# EAGLE schematic SMPS_Schematic (EAGLE 7.2.0)
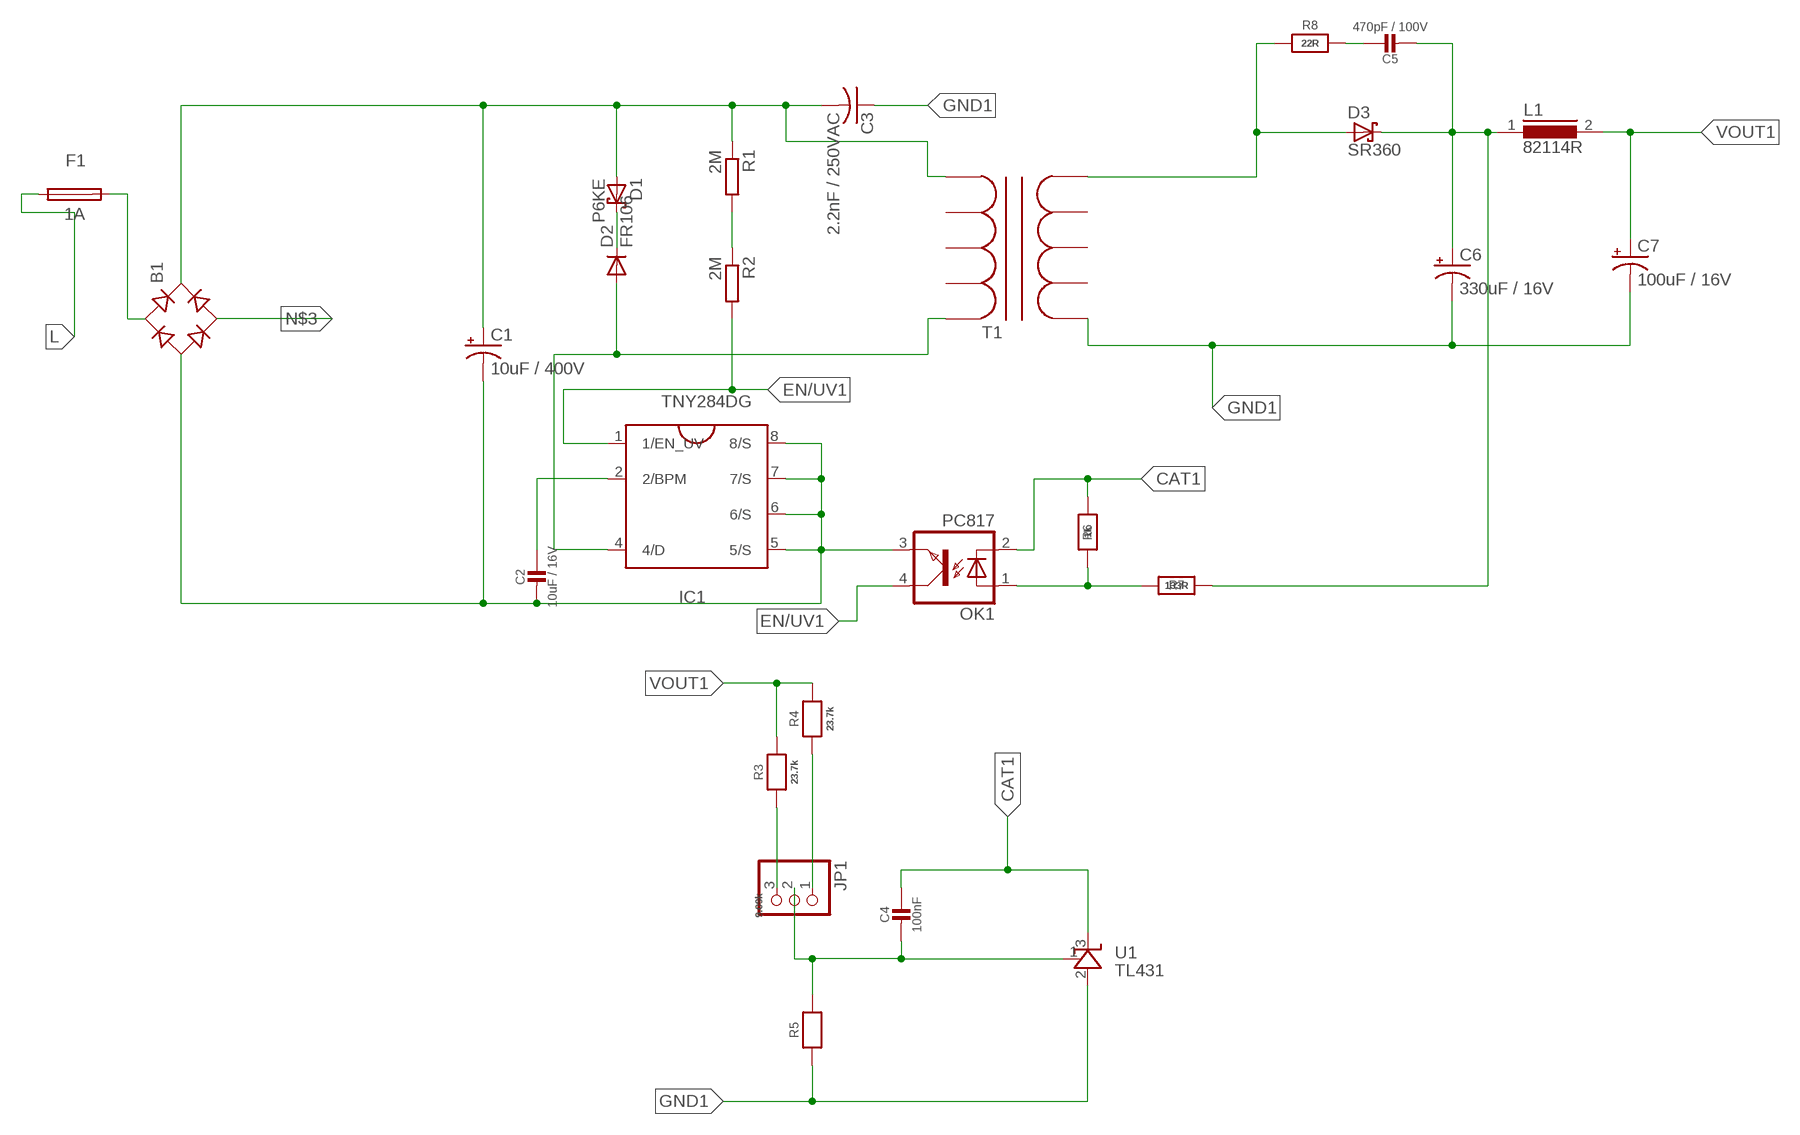
[diagram p0: schematic, sheet 1]

## Parts
B1  B-DIL  [B-DIL]
C1  10uF / 400V  CPOL-USE5-10.5  [E5-10,5]
C2  10uF / 16V  CAP_CERAMIC0805-NOOUTLINE  [0805-NO]
C3  2.2nF / 250VAC  C-US075-032X103  [C075-032X103]
C4  100nF  CAP_CERAMIC0805-NOOUTLINE  [0805-NO]
C5  470pF / 100V  CAP_CERAMIC0805-NOOUTLINE  [0805-NO]
C6  330uF / 16V  CPOL-USE3.5-8  [E3,5-8]
C7  100uF / 16V  CPOL-USE2.5-7  [E2,5-7]
D1  P6KE  P6KEXX  [CB417-15]
D2  FR106  1N4004  [DO41-10]
D3  SR360  SCHOTTKY-DIODEC4111-15  [C4111-15]
F1  1A  TR5  [TR5]
IC1  TNY284DG  TNY375-380SO8-C  [SO8-C(D_PACKAGE)]
JP1  PINHD-1X3  [1X03]
L1  82114R  [82114R]
OK1  PC817  [DIL04]
R1  2M  R-EU_M1206  [M1206]
R2  2M  R-EU_M1206  [M1206]
R3  23.7k  RESISTOR0805_NOOUTLINE  [0805-NO]
R4  23.7k  RESISTOR0805_NOOUTLINE  [0805-NO]
R5  9.09k  RESISTOR0805_NOOUTLINE  [0805-NO]
R6  1k  RESISTOR0805_NOOUTLINE  [0805-NO]
R7  133R  RESISTOR0805_NOOUTLINE  [0805-NO]
R8  22R  RESISTOR0805_NOOUTLINE  [0805-NO]
T1  TRANSFORMER_EE16  [EE16]
U1  TL431  [TO-92]

## Nets
AN1: C5.2 C6.+ D3.C L1.1 R7.2
BP/M: C2.1 IC1.2(2/BPM)
CAT1: C4.1 OK1.2(C) R6.1 U1.3(C)
DRAIN: D2.A IC1.4(4/D) T1.P$5
EN/UV1: IC1.1(1/EN_UV) OK1.4(COL) R2.2
GND1: C3.1 C6.- C7.- R5.1 T1.P$6 U1.2(A)
HV+: B1.+ C1.+ C3.2 D1.A R1.1 T1.P$1
L: F1.P$1
N$1: JP1.1 R4.1
N$2: JP1.3 R3.1
N$3: B1.AC2
N$5: OK1.1(A) R6.2 R7.1
N$6: D1.C D2.C
N$7: C5.1 R8.2
N$9: R1.2 R2.1
N$13: C4.2 JP1.2 R5.2 U1.1(REF)
N$50: B1.AC1 F1.P$2
SEC1: D3.A R8.1 T1.P$10
SOURCE: B1.- C1.- C2.2 IC1.5(5/S) IC1.6(6/S) IC1.7(7/S) IC1.8(8/S) OK1.3(EMIT)
VOUT1: C7.+ L1.2 R3.2 R4.2
Unconnected: T1.P$2 T1.P$3 T1.P$4 T1.P$7 T1.P$8 T1.P$9

## Library data of the parts
B1 = rectifier:B-DIL: RECTIFIER
C1 C6 C7 = resistor:CPOL-US: POLARIZED CAPACITOR, American symbol
C2 C4 C5 = microbuilder:CAP_CERAMIC: Ceramic Capacitors For new designs, use the packages preceded by an '_' character since they are more reliable: The following footprints should be used on most boards: _0402 - Standard footprint for regular board layouts _0603 - Standard footprint for regular board layouts _0805 - Standard footprint for regular board layouts _1206 - Standard footprint for regular board layouts For extremely tight-pitch boards where space is at a premium, the following 'micro-pitch' footprints can be used (smaller pads, no silkscreen outline, etc.): _0402MP - Micro-pitch footprint for very dense/compact boards _0603MP - Micro-pitch footprint for very dense/compact boards _0805MP - Micro-pitch footprint for very dense/compact boards _1206MP - Micro-pitch footprint for very dense/compact boards
C3 = resistor:C-US: CAPACITOR, American symbol
D1 = NRG Lib:P6KEXX: DIODE transient-voltage suppressor
D2 = NRG Lib:1N4004: DIODE General purpose 1N400x type rectifier (With bigger pads) http://www.ladyada.net/library/pcb/eaglelibrary.html
D3 = NRG Lib:SCHOTTKY-DIODE: Schottky Diode
F1 = nrg_single:TR5: FUSE Wickmann
IC1 = power_integrations:TNY375-380: TinySwitch-PK incorporates a 700 V MOSFET, oscillator, highvoltage switched current source, current limit (user selectable), and thermal shutdown circuitry. A unique peak mode feature boosts current limit and frequency for peak load conditions. The boosted current limit provides the peak output power while the increased peak mode frequency ensures the transformer can be sized for continuous load conditions rather than peak power demands.
JP1 = pinhead:PINHD-1X3: PIN HEADER
L1 = inductors:82114R: INDUCTOR
OK1 = NRG Lib:PC817: SHARP OPTO COUPLER; MPN: PC817X4J000F; OC_FARNELL: 9707727; OC_NEWARK: 97K7059
R1 R2 = resistor:R-EU_: RESISTOR, European symbol
R3-R8 = microbuilder:RESISTOR: Resistors For new designs, use the packages preceded by an '_' character since they are more reliable: The following footprints should be used on most boards: _0402 - Standard footprint for regular board layouts _0603 - Standard footprint for regular board layouts _0805 - Standard footprint for regular board layouts _1206 - Standard footprint for regular board layouts For extremely tight-pitch boards where space is at a premium, the following 'micro-pitch' footprints can be used (smaller pads, no silkscreen outline, etc.): _0402MP - Micro-pitch footprint for very dense/compact boards _0603MP - Micro-pitch footprint for very dense/compact boards _0805MP - Micro-pitch footprint for very dense/compact boards _1206MP - Micro-pitch footprint for very dense/compact boards
T1 = nrg_iso_rhythm:TRANSFORMER_EE16
U1 = NRG Lib:TL431